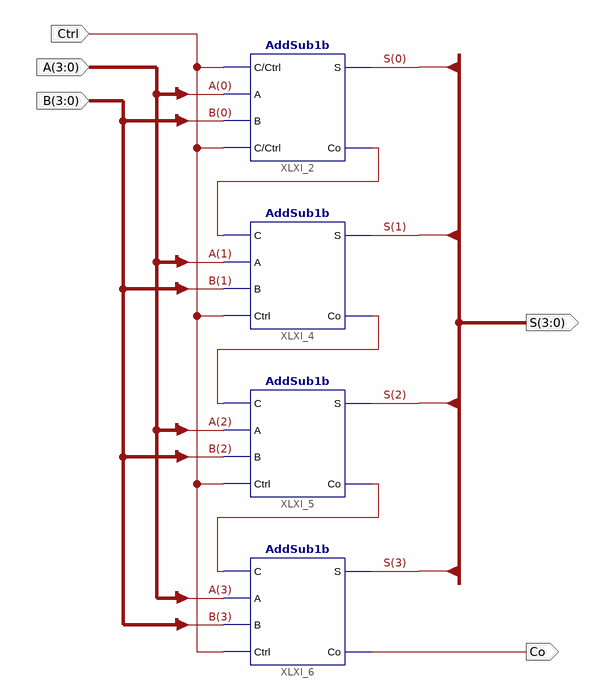
[diagram p0: schematic sheet 1]
// Xilinx ISE schematic AddSub4b.sch (kintex7) as structural Verilog: 4 symbols, 5 ports
module AddSub4b (
  input  Ctrl,
  input  [3:0] A,
  input  [3:0] B,
  output [3:0] S,
  output Co
);

  wire XLXN_12, XLXN_15, XLXN_17;

  AddSub1b XLXI_2 (.A(A[0]), .B(B[0]), .C(Ctrl), .Ctrl(Ctrl), .S(S[0]), .Co(XLXN_12));
  AddSub1b XLXI_4 (.A(A[1]), .B(B[1]), .C(XLXN_12), .Ctrl(Ctrl), .S(S[1]), .Co(XLXN_15));
  AddSub1b XLXI_5 (.A(A[2]), .B(B[2]), .C(XLXN_15), .Ctrl(Ctrl), .S(S[2]), .Co(XLXN_17));
  AddSub1b XLXI_6 (.A(A[3]), .B(B[3]), .C(XLXN_17), .Ctrl(Ctrl), .S(S[3]), .Co(Co));
endmodule
